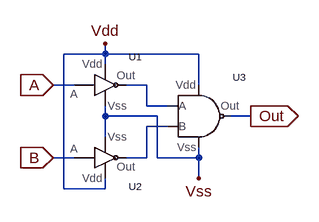
[diagram p0: schematic OR1.asc]
OR1.asc, the LTspice schematic file:
Version 4
SHEET 1 880 680
WIRE 112 64 112 48
WIRE 112 64 48 64
WIRE 256 64 112 64
WIRE 112 80 112 64
WIRE 64 112 32 112
WIRE 176 112 144 112
WIRE 256 112 256 64
WIRE 176 144 176 112
WIRE 208 144 176 144
WIRE 112 160 112 144
WIRE 192 160 112 160
WIRE 336 160 304 160
WIRE 208 176 176 176
WIRE 112 192 112 160
WIRE 64 224 32 224
WIRE 176 224 176 176
WIRE 176 224 144 224
WIRE 192 224 192 160
WIRE 256 224 256 208
WIRE 256 224 192 224
WIRE 256 256 256 224
WIRE 48 272 48 64
WIRE 112 272 112 256
WIRE 112 272 48 272
FLAG 32 112 A
IOPIN 32 112 In
FLAG 32 224 B
IOPIN 32 224 In
FLAG 336 160 Out
IOPIN 336 160 Out
FLAG 112 48 Vdd
FLAG 256 256 Vss
SYMBOL NOT1 96 112 R0
SYMATTR InstName U1
SYMBOL NOT1 96 224 M180
SYMATTR InstName U2
SYMBOL NAND1 224 160 R0
SYMATTR InstName U3

The netlist it stands for:
* OR1.asc
XU1 Vdd Vss A N001 NOT1  ; pins Vdd Vss A Out
XU2 Vdd Vss B N002 NOT1  ; pins Vdd Vss A Out
XU3 N001 N002 Out Vss Vdd NAND1  ; pins A B Out Vss Vdd
.lib NOT1.sub
.lib NAND1.sub
.backanno
.end